# EAGLE design ShaqJr-BOTTOM (EAGLE 9.6.2)
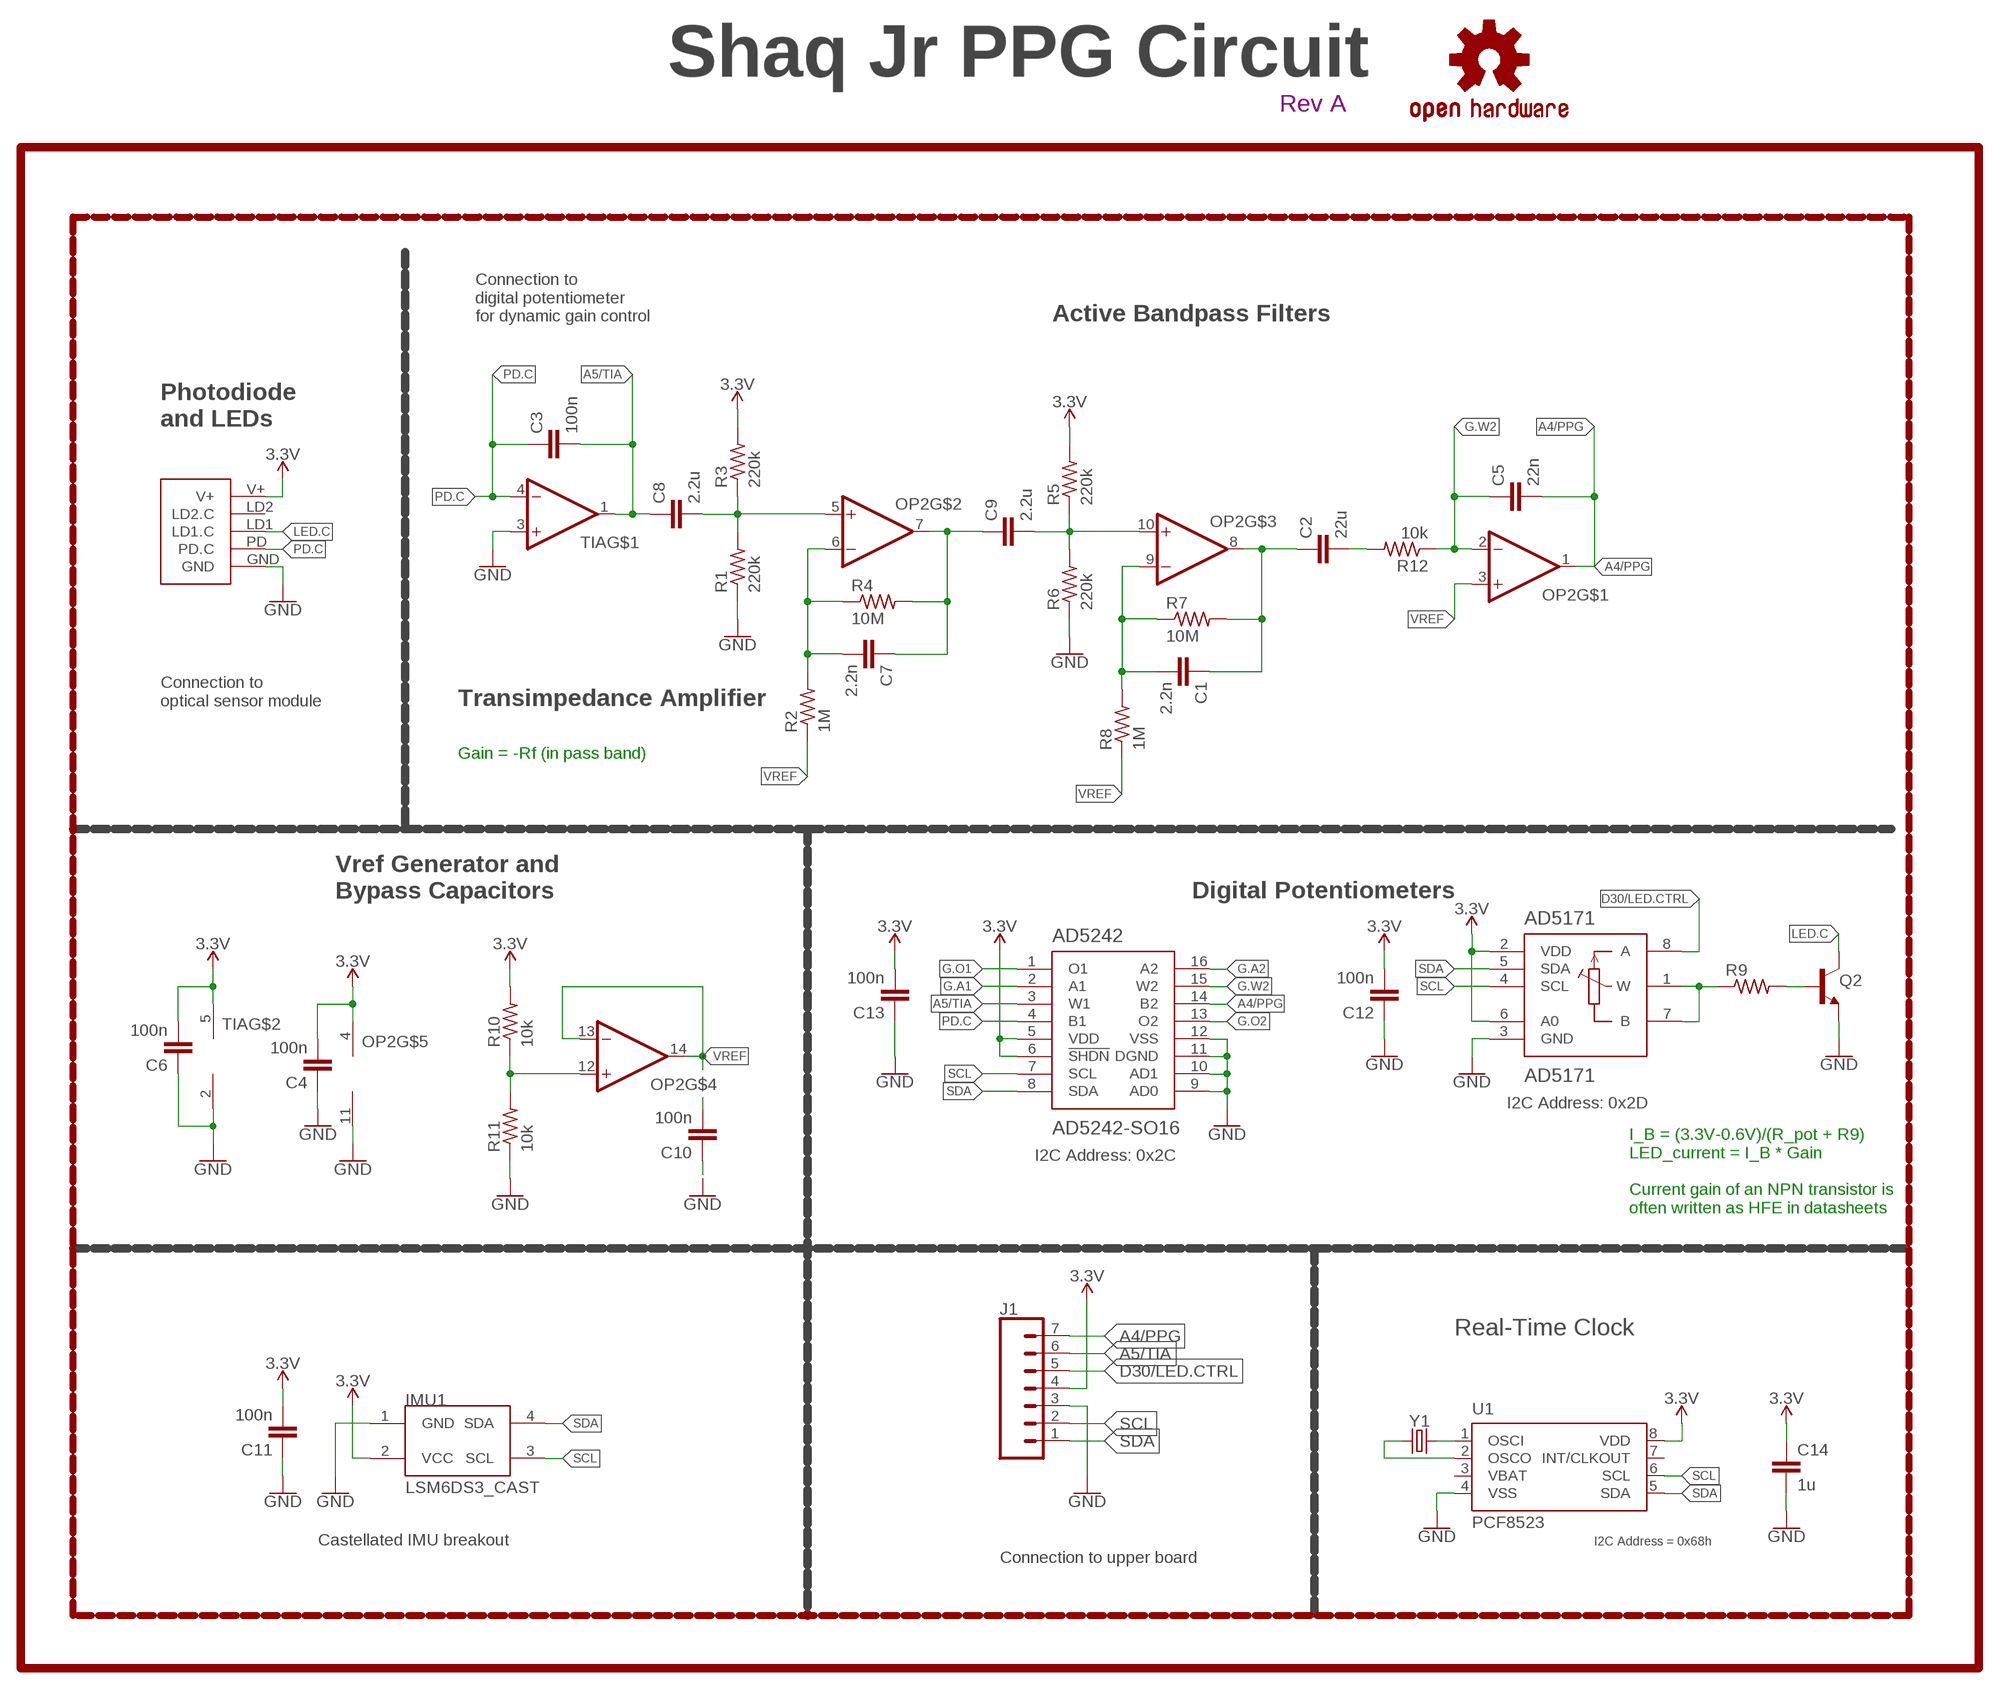
[diagram p0: schematic, sheet 1]

## Parts
AD5171  AD5171  [SOT-23-8]
AD5242  AD5242-SO16  [SO16]
C1  2.2n  CAPACITOR0603  [C0603]
C2  22u  CAPACITOR0603  [C0603]
C3  100n  CAPACITOR0603  [C0603]
C4  100n  CAPACITOR0603  [C0603]
C5  22n  CAPACITOR0603  [C0603]
C6  100n  CAPACITOR0603  [C0603]
C7  2.2n  CAPACITOR0603  [C0603]
C8  2.2u  CAPACITOR0603  [C0603]
C9  2.2u  CAPACITOR0603  [C0603]
C10  100n  CAPACITOR0603  [C0603]
C11  100n  CAPACITOR0603  [C0603]
C12  100n  CAPACITOR0603  [C0603]
C13  100n  CAPACITOR0603  [C0603]
C14  1u  CAPACITOR0603  [C0603]
IMU1  LSM6DS3_CAST  [LSM6DS3_CAST]
J1  CONN_07-1.27MM  [1X07_1.27MM]
LOGO1  REVISION.A  [REV.A]
LOGO2  OSHW-LOGOS  [OSHW-LOGO-S]
OP2  OP-QUAD-SO14  [SO14]
Q2  NPN-GENERIC  [SOT23-3]
R1  220k  RESISTOR0603  [R0603]
R2  1M  RESISTOR0603  [R0603]
R3  220k  RESISTOR0603  [R0603]
R4  10M  RESISTOR0603  [R0603]
R5  220k  RESISTOR0603  [R0603]
R6  220k  RESISTOR0603  [R0603]
R7  10M  RESISTOR0603  [R0603]
R8  1M  RESISTOR0603  [R0603]
R9  RESISTOR0603  [R0603]
R10  10k  RESISTOR0402  [R0402]
R11  10k  RESISTOR0402  [R0402]
R12  10k  RESISTOR0603  [R0603]
TIA  OP-SINGLEOT  [SOT23-5]
U1  PCF8523  [SO8]
U$1  PPG.MODULE.2  [PPG.MODULE.2]
Y1  32.7680kHz  CRYSTALECS-.327-12.5-12-C-TR  [2-SMD.NOLEAD.2.0MMTO1.2MM]

## Nets
3.3V: AD5171.2(VDD) AD5171.6(A0) AD5242.5(VDD) AD5242.6(!SHDN) C4.2 C6.2 C11.2 C12.2 C13.2 C14.1 IMU1.2(VCC) J1.4 OP2.4(V+) R3.2 R5.2 R10.2 TIA.5(V+) U1.8(VDD) U$1.V+
A4/PPG: AD5242.14(B2) C5.2 J1.7 OP2.1(OUT)
A5/TIA: AD5242.3(W1) C3.2 C8.1 J1.6 TIA.1(OUT)
D30/LED.CTRL: AD5171.8(A) J1.5
G.A1: AD5242.2(A1)
G.A2: AD5242.16(A2)
G.O1: AD5242.1(O1)
G.O2: AD5242.13(O2)
G.W2: AD5242.15(W2) C5.1 OP2.2(-IN) R12.1
GND: AD5171.3(GND) AD5242.9(AD0) AD5242.10(AD1) AD5242.11(DGND) AD5242.12(VSS) C4.1 C6.1 C10.1 C11.1 C12.1 C13.1 C14.2 IMU1.1(GND) J1.3 OP2.11(V-) Q2.2(E) R1.1 R6.1 R11.1 TIA.2(V-) TIA.3(+IN) U1.4(VSS) U$1.GND
LED.C: Q2.3(C) U$1.LD1(LD1.C)
N$1: C8.2 OP2.5(+IN) R1.2 R3.1
N$2: C9.2 OP2.10(+IN) R5.1 R6.2
N$3: C7.2 OP2.6(-IN) R2.2 R4.1
N$4: C7.1 C9.1 OP2.7(OUT) R4.2
N$5: C1.2 OP2.9(-IN) R7.1 R8.2
N$6: C1.1 C2.1 OP2.8(OUT) R7.2
N$7: C2.2 R12.2
N$9: U1.2(OSCO) Y1.P$1
N$10: U1.1(OSCI) Y1.P$2
N$11: Q2.1(B) R9.2
N$12: AD5171.1(W) AD5171.7(B) R9.1
N$14: OP2.12(+IN) R10.1 R11.2
PD.C: AD5242.4(B1) C3.1 TIA.4(-IN) U$1.PD(PD.C)
SCL: AD5171.4(SCL) AD5242.7(SCL) IMU1.3(SCL) J1.2 U1.6(SCL)
SDA: AD5171.5(SDA) AD5242.8(SDA) IMU1.4(SDA) J1.1 U1.5(SDA)
VREF: C10.2 OP2.3(+IN) OP2.13(-IN) OP2.14(OUT) R2.1 R8.1
Unconnected: U1.7(INT/CLKOUT) U$1.LD2(LD2.C)

## Notes on the sheet
- Shaq Jr PPG Circuit
- Connection to
  digital potentiometer
  for dynamic gain control
- Active Bandpass Filters
- Photodiode
  and LEDs
- Connection to
  optical sensor module
- Transimpedance Amplifier
- Gain = -Rf (in pass band)
- Vref Generator and 
  Bypass Capacitors
- Digital Potentiometers
- I2C Address: 0x2D
- I2C Address: 0x2C
- I_B = (3.3V-0.6V)/(R_pot + R9)
  LED_current = I_B * Gain
  
  Current gain of an NPN transistor is
  often written as HFE in datasheets
- Real-Time Clock
- Castellated IMU breakout | I2C Address = 0x68h
- Connection to upper board

## Power pins joined to a net without a drawn wire
VBAT: U1.3(VBAT)

## Library data of the parts
AD5171 = LinnesLab-DigitalIC:AD5171
AD5242 = LinnesLab-DigitalIC:AD5242
C1-C14 = LinnesLab-Passives:CAPACITOR
IMU1 = LinnesLab-Sensors:LSM6DS3_CAST
J1 = LinnesLab-Connectors:CONN_07: Multi connection point. Often used as Generic Header-pin footprint for 0.1 inch spaced/style header connections On any of the 0.1 inch spaced packages, you can populate with these: Break Away Headers - Straight <https://www.sparkfun.com/products/116> (PRT-00116) Break Away Male Headers - Right Angle <https://www.sparkfun.com/products/553> (PRT-00553) Female Headers <https://www.sparkfun.com/products/115> (PRT-00115) Break Away Headers - Machine Pin <https://www.sparkfun.com/products/117> (PRT-00117) Break Away Female Headers - Swiss Machine Pin <https://www.sparkfun.com/products/743> (PRT-00743) For SCREWTERMINALS and SPRING TERMINALS visit here: Screw Terimnals on SparkFun.com <https://www.sparkfun.com/search/results?term=Screw+Terminals> (5mm/3.5mm/2.54mm spacing) This device is also useful as a general connection point to wire up your design to another part of your project. Our various solder wires solder well into these plated through hole pads. Hook-Up Wire - Assortment (Stranded, 22 AWG) <https://www.sparkfun.com/products/11375> (PRT-11375) Hook-Up Wire - Assortment (Solid Core, 22 AWG) <https://www.sparkfun.com/products/11367> (PRT-11367) View the entire wire category on our website here <https://www.sparkfun.com/categories/141> Special notes: Molex polarized connector foot print use with SKU : PRT-08231 with associated crimp pins and housings. 1MM SMD Version SKU: PRT-10208 NOTES ON THE VARIANTS LOCK and LOCK_LONGPADS... This footprint was designed to help hold the alignment of a through-hole component (i.e. 6-pin header) while soldering it into place. You may notice that each hole has been shifted either up or down by 0.005 of an inch from it's more standard position (which is a perfectly straight line). This slight alteration caused the pins (the squares in the middle) to touch the edges of the holes. Because they are alternating, it causes a "brace" to hold the component in place. 0.005 has proven to be the perfect amount of "off-center" position when using our standard breakaway headers. Although looks a little odd when you look at the bare footprint, once you have a header in there, the alteration is very hard to notice. Also,if you push a header all the way into place, it is covered up entirely on the bottom side.
LOGO1 = LinnesLab-Logos:REVISION.A
LOGO2 = LinnesLab-Logos:OSHW-LOGO: Open-Source Hardware (OSHW) Logo This logo indicates the piece of hardware it is found on incorporates a OSHW license and/or adheres to the definition of open source hardware found here: http://freedomdefined.org/OSHW
OP2 = LinnesLab-AnalogIC:OP-QUAD: General symbol and footprints for Quad Op Amps. Use with any standard general purpose op amp.
Q2 = LinnesLab-DiscreteSemi:NPN
R1-R12 = LinnesLab-Passives:RESISTOR
TIA = LinnesLab-AnalogIC:OP-SINGLE: Single Op Amp 2.7V to 6.0V Single Supply CMOS Source: http://ww1.microchip.com/downloads/en/DeviceDoc/21314g.pdf
U1 = LinnesLab-Clocks:PCF8523; DIGIKEY: 568-5306-1-ND; I2C_ADDRESS: 0x68h; MFN: PCF8523T/1,118; MFN_MANUFACTURER: NXP USA Inc.
U$1 = LinnesLab-Connectors:PPG.MODULE.2: Digi-Key Part Number: S9014E-50-ND Manufacturer Part Number: GRPB501VWVN-RC Description: 1mm insulation height 0.05in pitch 50 positions
Y1 = LinnesLab-Clocks:CRYSTAL; DIGIKEY: XC2288CT-ND; FREQ: 32.7680KHZ; LOAD_CAP: 12.5pF

## Board
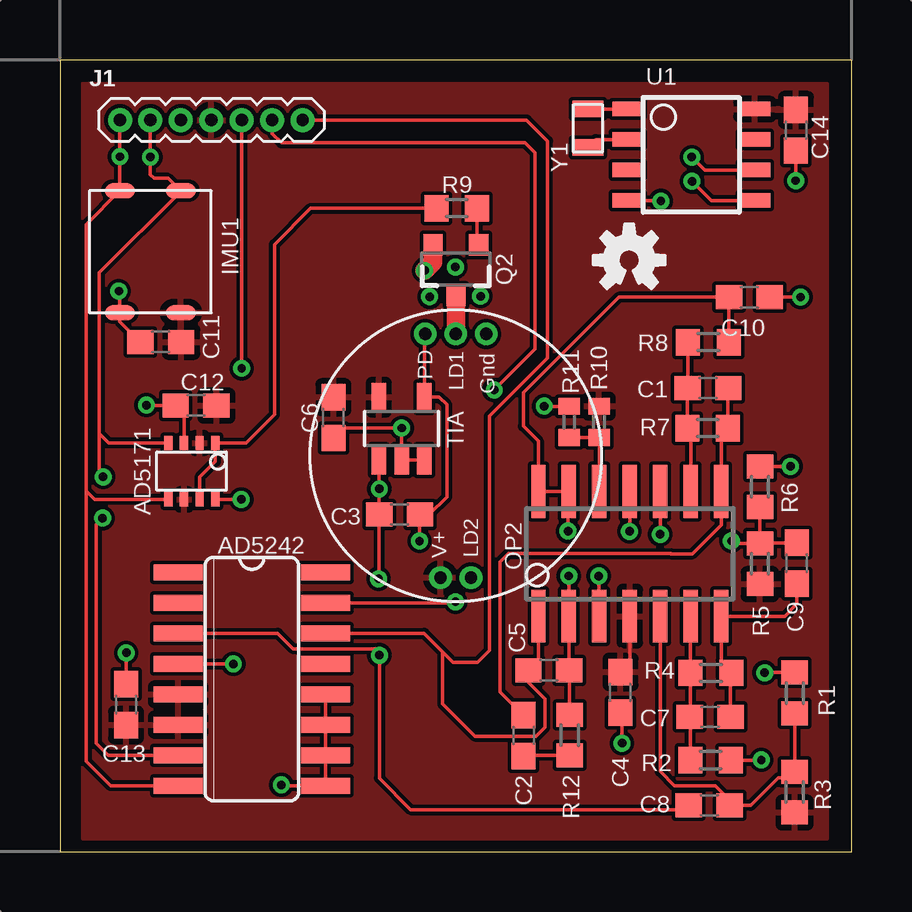
[diagram p1: board, top side]
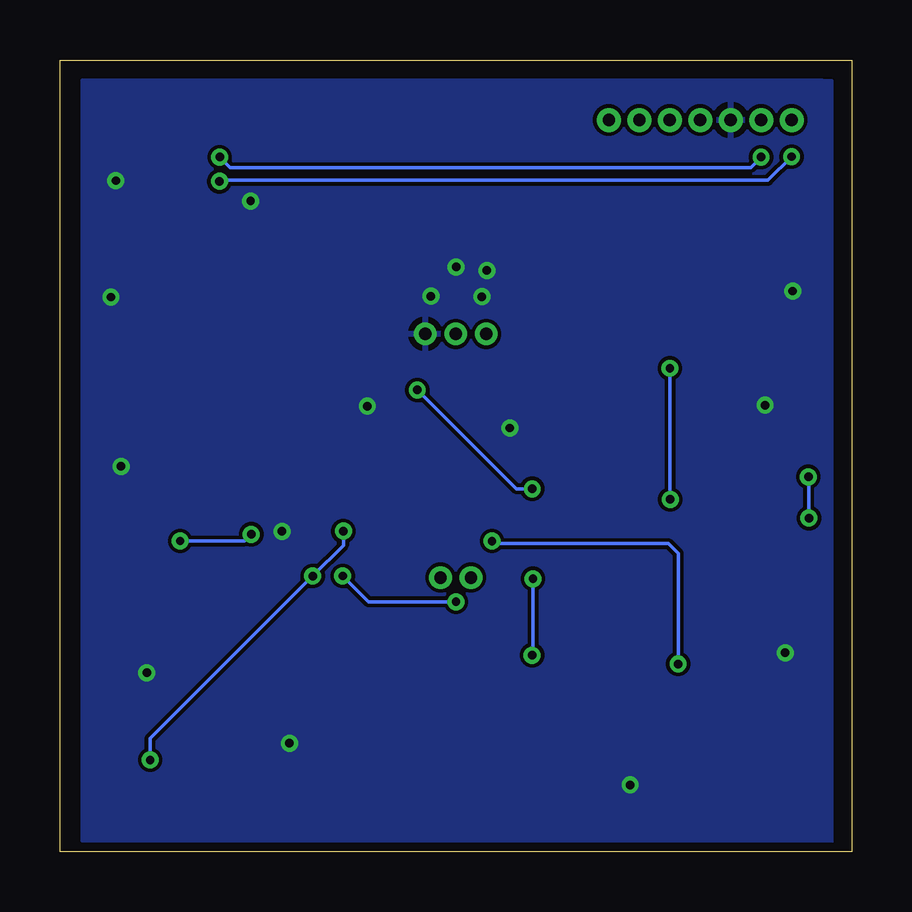
[diagram p2: board, bottom side, seen from below]

Size 33 x 33 mm. Coordinates in mm from the lower left corner, seen from the top.
Outline: 0,0 33,0 33,33 0,33 0,0
Copper layers (1*16): Top 0.0356mm / dielectric 1.5011mm / Bottom 0.0356mm
Design rules "LaenPCBOrder": minimum track width 6mil, minimum drill 13mil, track to track 6mil, track to pad 6mil, pad to pad 6mil, via to via 6mil, smd to smd 6mil, copper to edge 15mil, drill to drill 6mil, minimum pad ring 7mil, minimum via ring 7mil, stop-mask expansion 3mil, vias tented up to drill 0mil, thermal gap 10mil

### Footprints (pad centres in the part's own frame; a part is rotated, then mirrored left to right if it is on the bottom)
SOT-23-8 = smd 0.35 x 0.6: 1 -0.991,-1.176; 2 -0.341,-1.176; 3 0.309,-1.176; 4 0.959,-1.176; 5 0.959,1.176; 6 0.309,1.176; 7 -0.341,1.176; 8 -0.991,1.176
SO16 = smd 0.66 x 2.032: 1 -4.445,-3.073; 2 -3.175,-3.073; 3 -1.905,-3.073; 4 -0.635,-3.073; 5 0.635,-3.073; 6 1.905,-3.073; 7 3.175,-3.073; 8 4.445,-3.073; 9 4.445,3.073; 10 3.175,3.073; 11 1.905,3.073; 12 0.635,3.073; 13 -0.635,3.073; 14 -1.905,3.073; 15 -3.175,3.073; 16 -4.445,3.073
C0603 = smd 1.1 x 1: 1 -0.85,0; 2 0.85,0
LSM6DS3_CAST = smd 0.635 x 1.27: 1 -2.54,1.27; 2 -2.54,-1.27; 3 2.54,-1.27; 4 2.54,1.27
1X07_1.27MM = drill 0.508 pad 1: 1 0,0; 2 1.27,0; 3 2.54,0; 4 3.81,0; 5 5.08,0; 6 6.35,0; 7 7.62,0
SO14 = smd 0.6 x 2.2: 1 -3.81,-2.6; 2 -2.54,-2.6; 3 -1.27,-2.6; 4 0,-2.6; 5 1.27,-2.6; 6 2.54,-2.6; 7 3.81,-2.6; 8 3.81,2.6; 9 2.54,2.6; 10 1.27,2.6; 11 0,2.6; 12 -1.27,2.6; 13 -2.54,2.6; 14 -3.81,2.6
SOT23-3 = smd 0.8 x 0.9: 1 -0.95,-1; 2 0.95,-1; 3 0,1.1
R0603 = smd 1 x 1.1: 1 -0.85,0; 2 0.85,0
R0402 = smd 0.7 x 0.9: 1 -0.65,0; 2 0.65,0
SOT23-5 = smd 0.6 x 1.2: 1 -0.95,-1.306; 2 0,-1.306; 3 0.95,-1.306; 4 0.95,1.306; 5 -0.95,1.306
SO8 = smd 1.3 x 0.6: 1 -2.65,1.905; 2 -2.65,0.635; 3 -2.65,-0.635; 4 -2.65,-1.905; 5 2.65,-1.905; 6 2.65,-0.635; 7 2.65,0.635; 8 2.65,1.905
PPG.MODULE.2 = drill 0.508 pad 0.94: GND 1.27,5.08; LD1 0,5.08; LD2 0.635,-5.08; PD -1.27,5.08; V+ -0.635,-5.08
2-SMD.NOLEAD.2.0MMTO1.2MM = smd 0.7 x 1.3: P$1 -0.8,0; P$2 0.8,0

### Placement (x,y rotation side)
AD5171  5.48,15.86 180 top
AD5242  8,7.19 270 top
C1  27.01,19.33 180 top
C2  19.32,4.84 270 top
C3  14.16,14.06 180 top
C4  23.36,6.63 90 top
C5  20.38,7.56 180 top
C6  11.4,18.09 90 top
C7  27.1,5.62 180 top
C8  27.07,1.92 0 top
C9  30.72,12.02 90 top
C10  28.74,23.11 180 top
C11  4.2,21.24 0 top
C12  5.67,18.59 0 top
C13  2.75,6.12 270 top
C14  30.69,30.07 270 top
IMU1  3.77,25 90 top
J1  2.5,30.5 0 top
LOGO1  -12.75,-3.44 0 top  (outside the outline)
LOGO2  23.73,24.66 0 top
OP2  23.76,12.41 0 top
Q2  16.5,24.28 180 top
R1  30.63,6.61 270 top
R2  27.12,3.81 180 top
R3  30.63,2.48 270 top
R4  27.13,7.45 0 top
R5  29.18,12 270 top
R6  29.18,15.21 270 top
R7  27,17.65 0 top
R8  27.04,21.24 180 top
R9  16.54,26.82 0 top
R10  22.47,17.92 90 top
R11  21.23,17.91 270 top
R12  21.25,4.86 270 top
TIA  14.24,17.63 0 top
U1  26.32,29.05 0 top
U$1  16.5,16.5 0 top
Y1  22.01,30.15 90 top

### Tracks (layer width: path | path; a pad name or v marks a point on that pad's centre or on a via)
3.3V
  Top 0.152: OP2.4 23.76,7.88 C4.2
  pour Top: 31.98,32 31.98,0.54 0.96,0.54 0.96,32.03
A4/PPG
  Top 0.152: OP2.1 19.95,7.97 C5.2 19.53,7.05 20.21,6.37 20.21,5.17 19.85,4.8 17.3,4.8 15.96,6.15 15.96,8.31 | 15.96,8.31 15.18,9.1 AD5242.14 | 15.96,8.31 16.39,7.89 17.41,7.89 17.9,8.39 17.9,18.16 20.33,20.58 20.33,29.62 19.45,30.5 J1.7
A5/TIA  (via drill 0.35)
  Top 0.152: TIA.1 13.31,16.31 v13.31,15.12 C3.2 13.31,11.4 v13.28,11.37 | C8.1 26.04,1.74 14.62,1.74 13.31,3.05 v13.31,8.18 13.31,8.32 13.19,8.45 9.72,8.45 9.08,9.1 AD5242.3 | J1.6 8.85,29.93 9.23,29.55 19.39,29.55 19.81,29.13 19.81,20.96 18.1,19.25 v18.1,19.24
  Bottom 0.152: v13.28,11.37 13.28,8.22 v13.31,8.18 | v13.31,15.12 13.96,15.12 18.08,19.24 v18.1,19.24
D30/LED.CTRL  (via drill 0.35)
  Top 0.152: J1.5 v7.58,20.15 v7.57,20.15 | v7.56,14.68 AD5171.8
  Bottom 0.152: v7.57,20.15 7.57,14.69 v7.56,14.68
G.W2  (via drill 0.35)
  Top 0.152: R12.1 21.23,5.72 C5.1 21.22,7.58 OP2.2 v21.22,11.48 v21.21,11.49 | v16.49,10.41 16.45,10.37 AD5242.15
  Bottom 0.152: v16.49,10.41 20.14,10.41 v21.21,11.49
GND  (via drill 0.35)
  Top 0.152: R11.1 v20.19,18.56 | OP2.11 23.76,13.36 v23.74,13.35 | R6.1 v30.46,16.06 | R1.1 v29.38,7.46 v29.38,7.45 | C4.1 23.43,5.72 v23.43,4.52 | v2.76,8.29 2.75,8.27 C13.1 | v14.24,17.66 TIA.2 TIA.3 | v14.24,17.66 v14.25,17.66 | C6.1 11.81,17.66 v14.24,17.66 | AD5242.12 AD5242.11 AD5242.10 AD5242.9 9.26,2.75 v9.23,2.78 | C11.1 2.5,22.1 IMU1.1 2.5,23.41 v2.45,23.36 | AD5171.3 5.17,18.24 C12.1 3.62,18.59 v3.6,18.61 | C10.1 | C10.1 v30.88,23.11 | C14.2 30.69,27.98 v30.67,27.97 | U1.4 25.03,27.14 v25.05,27.12
  Top 0.762: Q2.2 15.55,24.57 v15.21,24.22
  other vias: 17.54,23.15 15.41,23.13 16.48,24.37
  pour Bottom: 1.21,32.16 32.07,32.16 32.07,0.44 0.83,0.41 0.83,32.14 1.3,32.14
LED.C
  Top 0.762: Q2.3 U$1.LD1
N$1
  Top 0.152: R1.2 R3.1 30.38,3.08 29.96,3.08 28.8,1.92 C8.2 27.68,2.16 27.68,2.39 27.33,2.75 25.61,2.75 25.03,3.33 OP2.5
N$2  (via drill 0.35)
  Top 0.152: C9.2 29.2,12.87 R5.1 | R6.2 R5.1 | R5.1 28.09,12.85 v27.99,12.95 | v25.03,13.23 OP2.10
  Bottom 0.152: v27.99,12.95 25.3,12.95 v25.03,13.23
N$3
  Top 0.152: OP2.6 26.28,9.8 R4.1 26.28,5.65 26.27,5.64 | 26.27,5.64 C7.2 | R2.2 26.27,5.64
N$4
  Top 0.152: C7.1 27.95,7.42 R4.2 27.57,7.87 OP2.7 30.21,9.81 30.72,10.32 C9.1
N$5
  Top 0.152: OP2.9 26.3,17.51 R7.1 26.15,19.32 C1.2 26.18,19.35 R8.2
N$6
  Top 0.152: C2.1 18.34,6.66 18.34,12.07 18.69,12.42 25.46,12.42 25.47,12.41 26.37,12.41 27.57,13.61 OP2.8 27.57,17.37 R7.2 27.85,19.32 C1.1
N$7
  Top 0.152: R12.2 19.34,4.01 C2.2
N$9
  Top 0.152: Y1.P$1 22.34,29.68 U1.2
N$10
  Top 0.152: U1.1 Y1.P$2
N$11
  Top 0.152: R9.2 17.39,25.34 Q2.1
N$12
  Top 0.152: R9.1 10.45,26.82 8.95,25.31 8.95,18.21 7.77,17.03 AD5171.1 6.47,16.25 5.82,15.61 AD5171.7
N$14
  Top 0.152: OP2.12 22.49,17.25 R10.1 R11.2
PD.C  (via drill 0.35)
  Top 0.152: U$1.PD 15.19,21.54 TIA.4 15.81,18.94 16.13,18.62 16.13,14.79 15.39,14.06 C3.1 14.99,14.04 v14.99,12.94 | AD5242.4 v7.22,7.82 v7.23,7.82
  Bottom 0.152: v7.23,7.82 7.23,12.43 7.64,12.84 14.89,12.84 v14.99,12.94
SCL  (via drill 0.35)
  Top 0.152: J1.2 v3.77,28.95 3.77,28.23 3.93,28.07 4.51,28.07 IMU1.3 5.02,27.52 1.63,24.13 1.63,17.42 1.64,17.42 | AD5242.7 2.01,4.01 1.52,4.5 1.52,13.64 v1.77,13.9 | 1.64,17.42 1.64,15.78 v1.8,15.62 | AD5171.4 2.03,17.03 1.64,17.42 | U1.6 26.88,28.41 v26.34,28.95
  Bottom 0.152: v1.77,13.9 1.77,15.6 v1.8,15.62 | v26.34,28.95 25.91,28.52 4.2,28.52 v3.77,28.95
SDA  (via drill 0.35)
  Top 0.152: J1.1 v2.5,28.97 IMU1.4 1.09,26.14 1.09,15.04 | AD5242.8 2.11,2.75 1.09,3.77 1.09,15.04 | AD5171.5 1.45,14.68 1.09,15.04 | U1.5 27.15,27.14 v26.35,27.94
  Bottom 0.152: v26.35,27.94 26.31,27.98 3.48,27.98 v2.5,28.97
VREF  (via drill 0.35)
  Top 0.152: R2.1 v29.23,3.81 v29.24,3.82 | v22.46,11.48 22.46,9.84 OP2.3 | v21.19,13.36 21.19,14.98 OP2.13 OP2.14 19.95,17.11 19.32,17.74 19.32,19.14 23.29,23.11 C10.2 R8.1
  Bottom 0.152: v29.24,3.82 29.24,4.71 v22.46,11.48 21.19,12.76 v21.19,13.36